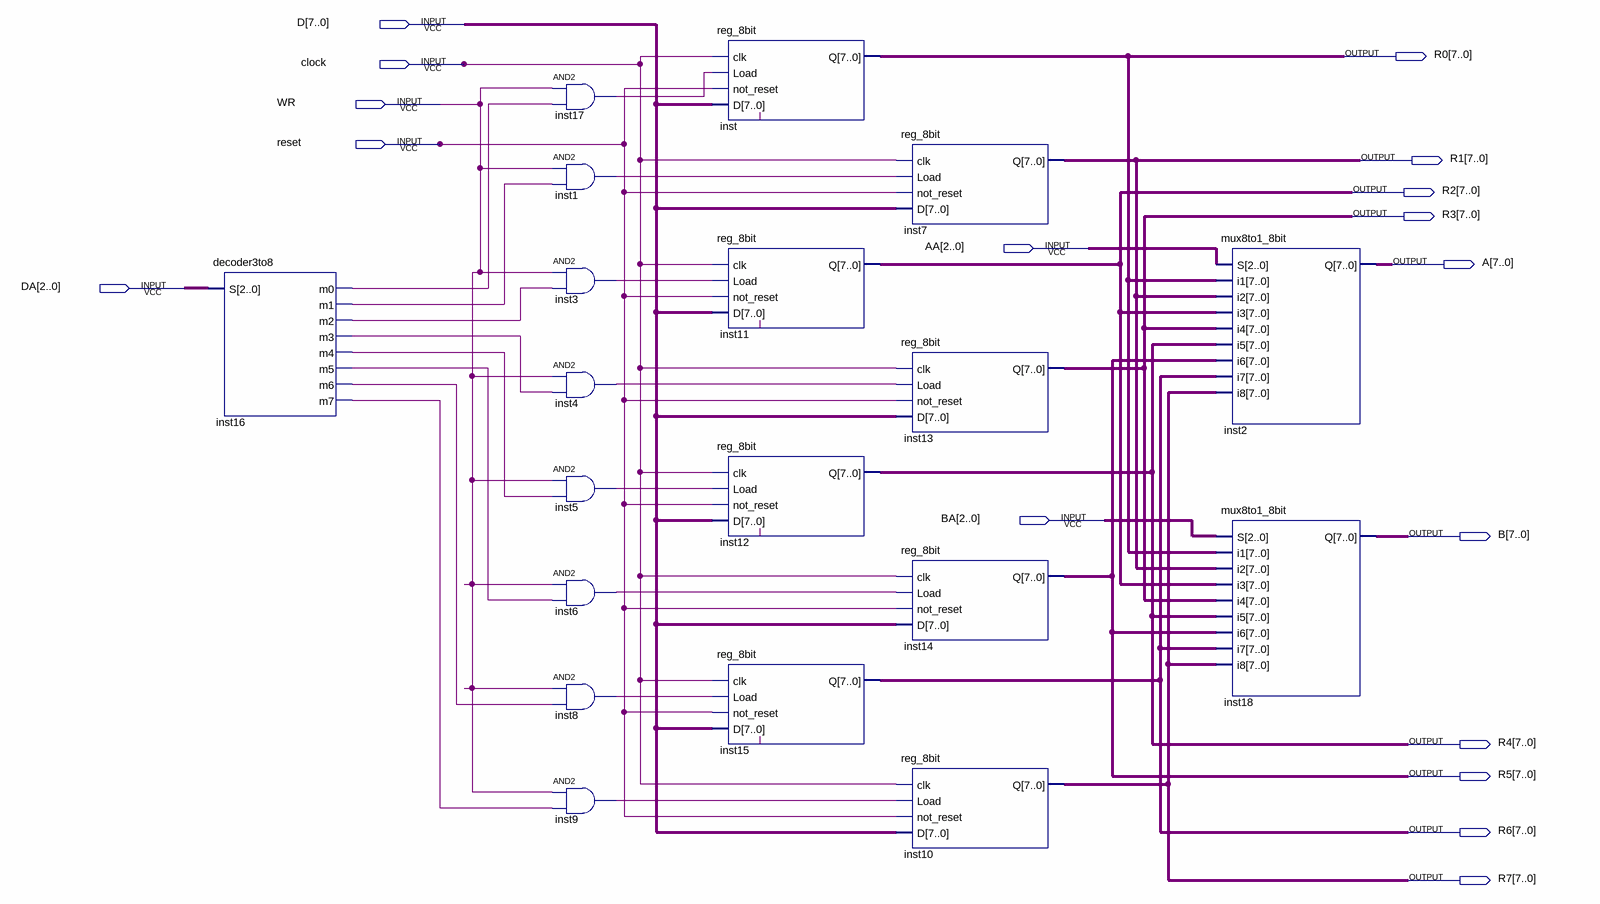
[diagram p0: schematic sheet]
// Quartus schematic reg_8x8_bit.bdf as structural Verilog: 19 symbols, 17 pins
module reg_8x8_bit (
  input  [7:0] D,
  input  clock,
  input  WR,
  input  reset,
  input  [2:0] AA,
  input  [2:0] DA,
  input  [2:0] BA,
  output [7:0] R0,
  output [7:0] R1,
  output [7:0] R2,
  output [7:0] R3,
  output [7:0] A,
  output [7:0] B,
  output [7:0] R4,
  output [7:0] R5,
  output [7:0] R6,
  output [7:0] R7
);

  wire inst1_out, inst3_out, inst4_out, inst5_out, inst6_out, inst8_out, inst9_out, inst16_m0, inst16_m1,
       inst16_m2, inst16_m3, inst16_m4, inst16_m5, inst16_m6, inst16_m7, inst17_out;

  decoder3to8 inst16 (
    .S(DA), .m0(inst16_m0), .m1(inst16_m1), .m2(inst16_m2), .m3(inst16_m3), .m4(inst16_m4), .m5(inst16_m5),
    .m6(inst16_m6), .m7(inst16_m7));
  and inst17 (inst17_out, WR, inst16_m0);
  and inst1 (inst1_out, WR, inst16_m1);
  and inst3 (inst3_out, WR, inst16_m2);
  and inst4 (inst4_out, WR, inst16_m3);
  and inst5 (inst5_out, WR, inst16_m4);
  and inst6 (inst6_out, WR, inst16_m5);
  and inst8 (inst8_out, WR, inst16_m6);
  and inst9 (inst9_out, WR, inst16_m7);
  reg_8bit inst (.clk(clock), .Load(inst17_out), .not_reset(reset), .D(D), .Q(R0));
  reg_8bit inst11 (.clk(clock), .Load(inst3_out), .not_reset(reset), .D(D), .Q(R2));
  reg_8bit inst12 (.clk(clock), .Load(inst5_out), .not_reset(reset), .D(D), .Q(R4));
  reg_8bit inst15 (.clk(clock), .Load(inst8_out), .not_reset(reset), .D(D), .Q(R6));
  reg_8bit inst7 (.clk(clock), .Load(inst1_out), .not_reset(reset), .D(D), .Q(R1));
  reg_8bit inst13 (.clk(clock), .Load(inst4_out), .not_reset(reset), .D(D), .Q(R3));
  reg_8bit inst14 (.clk(clock), .Load(inst6_out), .not_reset(reset), .D(D), .Q(R5));
  reg_8bit inst10 (.clk(clock), .Load(inst9_out), .not_reset(reset), .D(D), .Q(R7));
  mux8to1_8bit inst2 (.S(AA), .i1(R0), .i2(R1), .i3(R2), .i4(R3), .i5(R4), .i6(R5), .i7(R6), .i8(R7), .Q(A));
  mux8to1_8bit inst18 (.S(BA), .i1(R0), .i2(R1), .i3(R2), .i4(R3), .i5(R4), .i6(R5), .i7(R6), .i8(R7), .Q(B));
endmodule
